# Altium schematic sheet 03_CPU_PIO.SchDoc
size A3; SheetNumber: 2
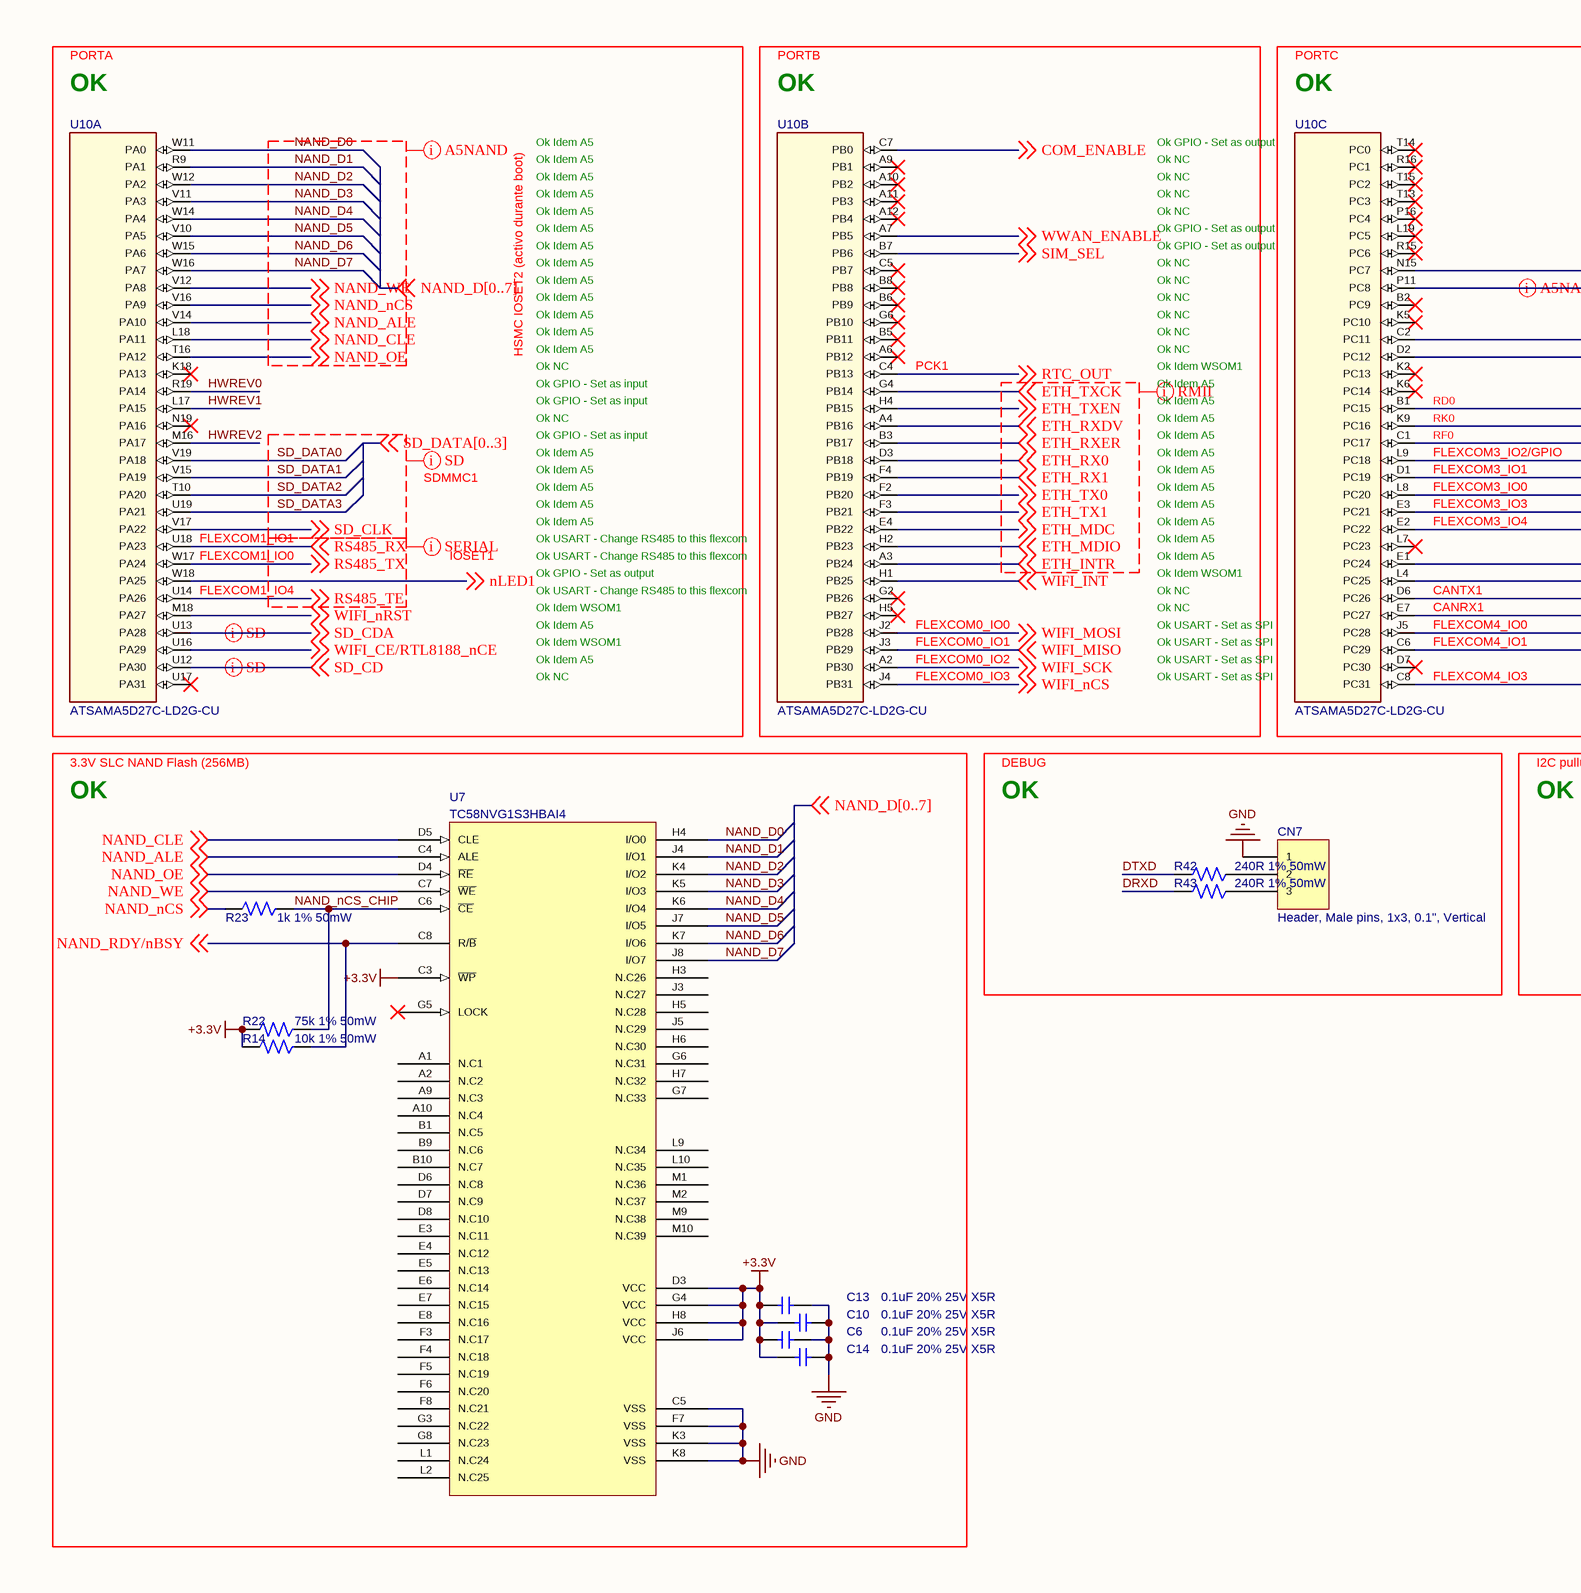
[diagram p0: 03_CPU_PIO.SchDoc, left]
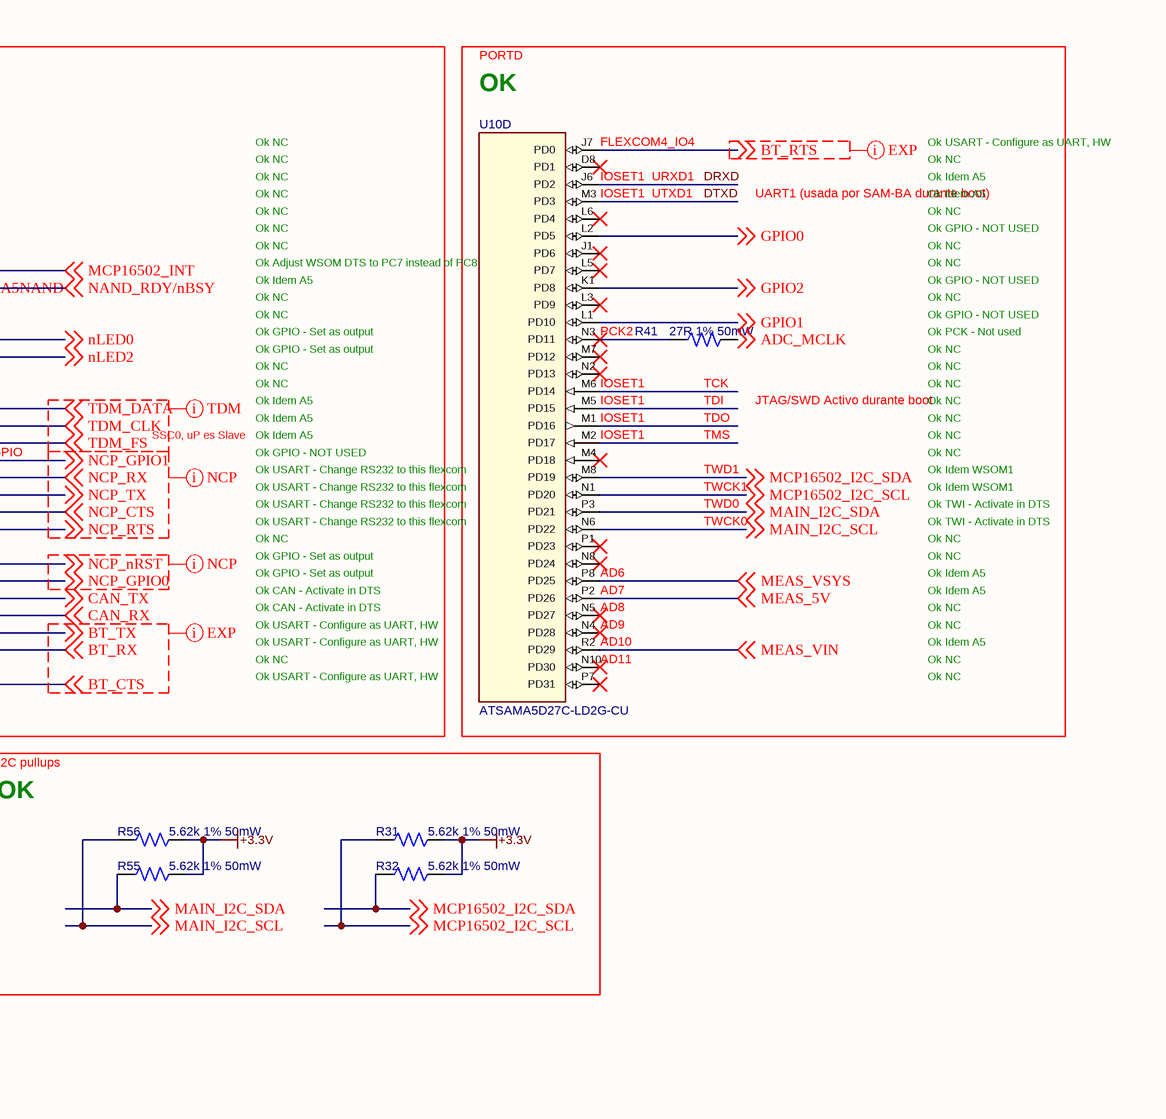
[diagram p1: 03_CPU_PIO.SchDoc, right]

## Parts
C6  0.1uF 20% 25V X5R  [CAPC1005N]
C10  0.1uF 20% 25V X5R  [CAPC1005N]
C13  0.1uF 20% 25V X5R  [CAPC1005N]
C14  0.1uF 20% 25V X5R  [CAPC1005N]
CN7  Header, Male pins, 1x3, 0.1", Vertical  [HDR1X3]
R14  10k 1% 50mW  [RESC1005X40N]
R22  75k 1% 50mW  [RESC1005X40N]
R23  1k 1% 50mW  [RESC1005X40N]
R31  5.62k 1% 50mW  [RESC1005X40N]
R32  5.62k 1% 50mW  [RESC1005X40N]
R41  27R 1% 50mW  [RESC1005X40N]
R42  240R 1% 50mW  [RESC1005X40N]
R43  240R 1% 50mW  [RESC1005X40N]
R55  5.62k 1% 50mW  [RESC1005X40N]
R56  5.62k 1% 50mW  [RESC1005X40N]
U7  TC58NVG1S3HBAI4  [VFBGA63-11x9]
U10  ATSAMA5D27C-LD2G-CU  [TFBGA-361-16X16]  (parts A,B,C,D of 7)

## Blocks framed on the sheet
OK: U10
OK: U10
OK: U10
OK: R41 U10
OK: C6 C10 C13 C14 R14 R22 R23 U7
OK: CN7 R42 R43
OK: R31 R32 R55 R56

## Nets
+3.3V: C6.1 C10.1 C13.1 C14.1 R14.2 R22.2 R31.2 R32.2 R55.2 R56.2 U7.C3(~{WP}) U7.D3(VCC) U7.G4(VCC) U7.H8(VCC) U7.J6(VCC)
GND: C6.2 C10.2 C13.2 C14.2 CN7.1 U7.C5(VSS) U7.F7(VSS) U7.K3(VSS) U7.K8(VSS)
ADC_MCLK: R41.2 ; off-sheet ADC_MCLK
BT_CTS: U10.C8(PC31) ; off-sheet BT_CTS
BT_RTS: U10.J7(PD0) ; off-sheet BT_RTS
BT_RX: U10.C6(PC29) ; off-sheet BT_RX
BT_TX: U10.J5(PC28) ; off-sheet BT_TX
CAN_RX: U10.E7(PC27) ; off-sheet CAN_RX
CAN_TX: U10.D6(PC26) ; off-sheet CAN_TX
COM_ENABLE: U10.C7(PB0) ; off-sheet COM_ENABLE
DRXD: R43.1 U10.J6(PD2)
DTXD: R42.1 U10.M3(PD3)
ETH_INTR: U10.A3(PB24) ; off-sheet ETH_INTR
ETH_MDC: U10.E4(PB22) ; off-sheet ETH_MDC
ETH_MDIO: U10.H2(PB23) ; off-sheet ETH_MDIO
ETH_RX0: U10.D3(PB18) ; off-sheet ETH_RX0
ETH_RX1: U10.F4(PB19) ; off-sheet ETH_RX1
ETH_RXDV: U10.A4(PB16) ; off-sheet ETH_RXDV
ETH_RXER: U10.B3(PB17) ; off-sheet ETH_RXER
ETH_TX0: U10.F2(PB20) ; off-sheet ETH_TX0
ETH_TX1: U10.F3(PB21) ; off-sheet ETH_TX1
ETH_TXCK: U10.G4(PB14) ; off-sheet ETH_TXCK
ETH_TXEN: U10.H4(PB15) ; off-sheet ETH_TXEN
GPIO0: U10.L2(PD5) ; off-sheet GPIO0
GPIO1: U10.L1(PD10) ; off-sheet GPIO1
GPIO2: U10.K1(PD8) ; off-sheet GPIO2
HWREV0: U10.R19(PA14)
HWREV1: U10.L17(PA15)
HWREV2: U10.M16(PA17)
MAIN_I2C_SCL: R56.1 U10.N6(PD22) ; off-sheet MAIN_I2C_SCL
MAIN_I2C_SDA: R55.1 U10.P3(PD21) ; off-sheet MAIN_I2C_SDA
MCP16502_I2C_SCL: R31.1 U10.N1(PD20) ; off-sheet MCP16502_I2C_SCL
MCP16502_I2C_SDA: R32.1 U10.M8(PD19) ; off-sheet MCP16502_I2C_SDA
MCP16502_INT: U10.N15(PC7) ; off-sheet MCP16502_INT
MEAS_5V: U10.P2(PD26) ; off-sheet MEAS_5V
MEAS_VIN: U10.R2(PD29) ; off-sheet MEAS_VIN
MEAS_VSYS: U10.P8(PD25) ; off-sheet MEAS_VSYS
NAND_ALE: U7.C4(ALE) U10.V14(PA10) ; off-sheet NAND_ALE
NAND_CLE: U7.D5(CLE) U10.L18(PA11) ; off-sheet NAND_CLE
NAND_D0: U7.H4(I/O0) U10.W11(PA0)
NAND_D1: U7.J4(I/O1) U10.R9(PA1)
NAND_D2: U7.K4(I/O2) U10.W12(PA2)
NAND_D3: U7.K5(I/O3) U10.V11(PA3)
NAND_D4: U7.K6(I/O4) U10.W14(PA4)
NAND_D5: U7.J7(I/O5) U10.V10(PA5)
NAND_D6: U7.K7(I/O6) U10.W15(PA6)
NAND_D7: U7.J8(I/O7) U10.W16(PA7)
NAND_nCS: R23.2 U10.V16(PA9) ; off-sheet NAND_nCS
NAND_nCS_CHIP: R22.1 R23.1 U7.C6(~{CE})
NAND_OE: U7.D4(~{RE}) U10.T16(PA12) ; off-sheet NAND_OE
NAND_RDY/nBSY: R14.1 U7.C8(R/~{B}) U10.P11(PC8) ; off-sheet NAND_RDY/nBSY
NAND_WE: U7.C7(~{WE}) U10.V12(PA8) ; off-sheet NAND_WE
NCP_CTS: U10.E3(PC21) ; off-sheet NCP_CTS
NCP_GPIO0: U10.L4(PC25) ; off-sheet NCP_GPIO0
NCP_GPIO1: U10.L9(PC18) ; off-sheet NCP_GPIO1
NCP_nRST: U10.E1(PC24) ; off-sheet NCP_nRST
NCP_RTS: U10.E2(PC22) ; off-sheet NCP_RTS
NCP_RX: U10.D1(PC19) ; off-sheet NCP_RX
NCP_TX: U10.L8(PC20) ; off-sheet NCP_TX
nLED0: U10.C2(PC11) ; off-sheet nLED0
nLED1: U10.W18(PA25) ; off-sheet nLED1
nLED2: U10.D2(PC12) ; off-sheet nLED2
RS485_RX: U10.U18(PA23) ; off-sheet RS485_RX
RS485_TE: U10.U14(PA26) ; off-sheet RS485_TE
RS485_TX: U10.W17(PA24) ; off-sheet RS485_TX
RTC_OUT: U10.C4(PB13) ; off-sheet RTC_OUT
SD_CD: U10.U12(PA30) ; off-sheet SD_CD
SD_CDA: U10.U13(PA28) ; off-sheet SD_CDA
SD_CLK: U10.V17(PA22) ; off-sheet SD_CLK
SD_DATA0: U10.V19(PA18)
SD_DATA1: U10.V15(PA19)
SD_DATA2: U10.T10(PA20)
SD_DATA3: U10.U19(PA21)
SIM_SEL: U10.B7(PB6) ; off-sheet SIM_SEL
TDM_CLK: U10.K9(PC16) ; off-sheet TDM_CLK
TDM_DATA: U10.B1(PC15) ; off-sheet TDM_DATA
TDM_FS: U10.C1(PC17) ; off-sheet TDM_FS
WIFI_CE/RTL8188_nCE: U10.U16(PA29) ; off-sheet WIFI_CE/RTL8188_nCE
WIFI_INT: U10.H1(PB25) ; off-sheet WIFI_INT
WIFI_MISO: U10.J3(PB29) ; off-sheet WIFI_MISO
WIFI_MOSI: U10.J2(PB28) ; off-sheet WIFI_MOSI
WIFI_nCS: U10.J4(PB31) ; off-sheet WIFI_nCS
WIFI_nRST: U10.M18(PA27) ; off-sheet WIFI_nRST
WIFI_SCK: U10.A2(PB30) ; off-sheet WIFI_SCK
WWAN_ENABLE: U10.A7(PB5) ; off-sheet WWAN_ENABLE
NetCN7_2: CN7.2 R42.2
NetCN7_3: CN7.3 R43.2
NetR41_1: R41.1 U10.N3(PD11)

Not connected (* = marked no-connect by the designer): U7 A1(N.C1) A2(N.C2) A9(N.C3) A10(N.C4) B1(N.C5) B9(N.C6) B10(N.C7) D6(N.C8) D7(N.C9) D8(N.C10) E3(N.C11) E4(N.C12) E5(N.C13) E6(N.C14) E7(N.C15) E8(N.C16) F3(N.C17) F4(N.C18) F5(N.C19) F6(N.C20) F8(N.C21) G3(N.C22) G5(LOCK)* G6(N.C31) G7(N.C33) G8(N.C23) H3(N.C26) H5(N.C28) H6(N.C30) H7(N.C32) J3(N.C27) J5(N.C29) L1(N.C24) L2(N.C25) L9(N.C34) L10(N.C35) M1(N.C36) M2(N.C37) M9(N.C38) M10(N.C39); U10 A6(PB12)* A9(PB1)* A10(PB2)* A11(PB3)* A12(PB4)* B2(PC9)* B5(PB11)* B6(PB9)* B8(PB8)* C5(PB7)* D7(PC30)* D8(PD1)* G2(PB26)* G6(PB10)* H5(PB27)* J1(PD6)* K2(PC13)* K5(PC10)* K6(PC14)* K18(PA13)* L3(PD9)* L5(PD7)* L6(PD4)* L7(PC23)* L19(PC5)* M1(PD16) M2(PD17) M4(PD18)* M5(PD15) M6(PD14) M7(PD12)* N2(PD13)* N4(PD28)* N5(PD27)* N8(PD24)* N10(PD30)* N19(PA16)* P1(PD23)* P7(PD31)* P16(PC4)* R15(PC6)* R16(PC1)* T13(PC3)* T14(PC0)* T15(PC2)* U17(PA31)*

## Layout directives
net class BUS_A5NAND: NAND_ALE, NAND_CLE, NAND_D0, NAND_D1, NAND_D2, NAND_D3, NAND_D4, NAND_D5, NAND_D6, NAND_D7, NAND_D[0..7], NAND_nCS, NAND_OE, NAND_RDY/nBSY, NAND_WE
net class BUS_RMII: ETH_INTR, ETH_MDC, ETH_MDIO, ETH_RX0, ETH_RX1, ETH_RXDV, ETH_RXER, ETH_TX0, ETH_TX1, ETH_TXCK, ETH_TXEN
net class SD: SD_CD, SD_CDA, SD_CLK, SD_DATA0, SD_DATA1, SD_DATA2, SD_DATA3, SD_DATA[0..3]
net class NCP: NCP_CTS, NCP_GPIO0, NCP_GPIO1, NCP_nRST, NCP_RTS, NCP_RX, NCP_TX
net class SERIAL: RS485_RX, RS485_TE, RS485_TX
net class EXP: BT_CTS, BT_RTS, BT_RX, BT_TX
net class TDM: TDM_CLK, TDM_DATA, TDM_FS

## Notes on the sheet
- PORTA
- PORTB
- PORTC
- PORTD
- Ok
- Idem A5
- NC
- GPIO - Set as output
- (near U10) IOSET1
- (near U10) FLEXCOM4_IO4
- URXD1
- UTXD1
- UART1 (usada por SAM-BA durante boot)
- USART - Configure as UART, HW
- Adjust WSOM DTS to PC7 instead of PC8
- GPIO - NOT USED
- HSMC IOSET2 (activo durante boot)
- (near U10) PCK1
- Idem WSOM1
- (near U10) PCK2
- PCK - Not used
- GPIO - Set as input
- (near U10) RD0
- (near U10) RK0
- (near U10) RF0
- (near U10) FLEXCOM3_IO2/GPIO
- SSC0, uP es Slave
- (near R41) TDI
- TDO
- (near R41) TCK
- TMS
- (near R41) JTAG/SWD Activo durante boot
- (near U10) FLEXCOM1_IO1
- SDMMC1
- USART - Change RS485 to this flexcom
- (near U10) FLEXCOM3_IO1
- (near U10) FLEXCOM3_IO0
- (near U10) FLEXCOM3_IO4
- (near U10) FLEXCOM3_IO3
- USART - Change RS232 to this flexcom
- TWD1
- TWCK1
- TWD0
- TWCK0
- TWI - Activate in DTS
- (near U10) FLEXCOM1_IO0
- (near U10) FLEXCOM1_IO4
- IOSET1
- (near U10) FLEXCOM0_IO0
- USART - Set as SPI
- (near U10) FLEXCOM4_IO0
- (near U10) CANRX1
- (near U10) CANTX1
- CAN - Activate in DTS
- (near U10) AD6
- (near U10) AD7
- (near U10) AD8
- (near U10) AD9
- (near U10) FLEXCOM0_IO1
- (near U10) FLEXCOM0_IO2
- (near U10) FLEXCOM0_IO3
- (near U10) FLEXCOM4_IO1
- (near U10) FLEXCOM4_IO3
- (near U10) AD10
- (near U10) AD11
- 3.3V SLC NAND Flash (256MB)
- DEBUG
- I2C pullups

## Library data of the parts
C6 C10 C13 C14 = C_Dup1: Capacitor, Ceramic; FP_DESC: C0402; MFG_PN: CL05A104KA5NNNC; MFG: SAMSUNG; Symbol Checked: Ok; Replacement Allowed: Ask; Footprint Checked: Assign OK, Footprint OK; TECHNOLOGY: X5R; TOLERANCE: 20%; VALUE: 0.1uF; VOLTAGE: 25V
CN7 = Header 3: MFG: <GENERIC>; Symbol Checked: Ok; Replacement Allowed: Yes; FP_DESC: Header, Male pins, 1x3, 0.1", Vertical; MFG_PN: <GENERIC>; Footprint Checked: Assign OK, Footprint OK
R14 R22 R23 R31 R32 R55 R56 = R: Resistor, SMD; FP_DESC: R0402; MFG_PN: <GENERIC>; Symbol Checked: Ok; Replacement Allowed: Yes; MFG: <GENERIC>; Footprint Checked: Assign OK, Footprint OK; POWER: 50mW; TOLERANCE: 1%
  R14: VALUE: 10k
  R22: VALUE: 75k
  R23: VALUE: 1k
  R31 R32 R55 R56: VALUE: 5.62k
R41-R43 = R: Resistor, SMD; MFG: <GENERIC>; FP_DESC: R0402; Symbol Checked: Ok; Replacement Allowed: Yes; MFG_PN: <GENERIC>; Footprint Checked: Assign OK, Footprint OK; POWER: 50mW; TOLERANCE: 1%
  R41: VALUE: 27R
  R42 R43: VALUE: 240R
U7 = S34MS01G200: SLC NAND Flash Memory for Embedded; FP_DESC: FBGA63; MFG: TOSHIBA; Symbol Checked: Ok; Replacement Allowed: No; MFG_PN: TC58NVG1S3HBAI4; Footprint Checked: Assign OK, Footprint OK
U10 = MIC8130: SAMA5D2 MPU with 2Gb LPDDR2 x32 TFBGA-361; MFG: MICROCHIP; Symbol Checked: Ok; Replacement Allowed: No; Footprint Checked: Assign OK, Footprint OK; FP_DESC: BGA-361; MFG_PN: ATSAMA5D27C-LD2G-CU